# Altium project SCP.PrjPcb
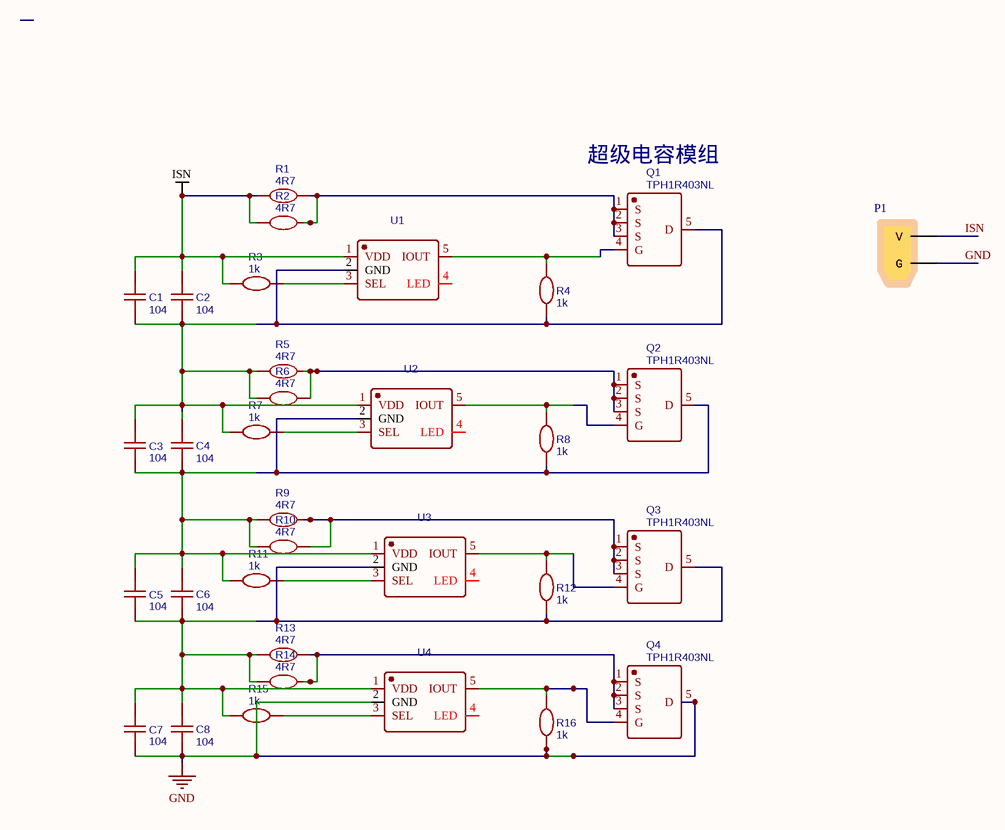
[diagram p0: SCP.SchDoc]
1 sheet, 33 parts. Net scope: global (net labels, ports and power ports of the same name join across sheets).
Board file: SCP.PcbDoc

## Sheet SCP.SchDoc
size A4; SheetNumber: 1; SheetTotal: 1

### Parts
C1  104  [C0805]
C2  104  [PCBComponent_1 - duplicate]
C3  104  [C0805]
C4  104  [PCBComponent_1 - duplicate]
C5  104  [C0805]
C6  104  [PCBComponent_1 - duplicate]
C7  104  [C0805]
C8  104  [PCBComponent_1 - duplicate]
P1  (no value)  [XT30 DIP]
Q1  TPH1R403NL  [POWERVDFN-8_L6.2-W5.2-P1.27-LS6.0-BL]
Q2  TPH1R403NL  [POWERVDFN-8_L6.2-W5.2-P1.27-LS6.0-BL]
Q3  TPH1R403NL  [POWERVDFN-8_L6.2-W5.2-P1.27-LS6.0-BL]
Q4  TPH1R403NL  [POWERVDFN-8_L6.2-W5.2-P1.27-LS6.0-BL]
R1  4R7  [R2512 1]
R2  4R7  [R2512 1]
R3  1k  [R0603]
R4  1k  [R0603]
R5  4R7  [R2512 1]
R6  4R7  [R2512 1]
R7  1k  [R0603]
R8  1k  [R0603]
R9  4R7  [R2512 1]
R10  4R7  [R2512 1]
R11  1k  [R0603]
R12  1k  [R0603]
R13  4R7  [R2512 1]
R14  4R7  [R2512 1]
R15  1k  [R0603]
R16  1k  [R0603]
U1  (no value)  [TSOT-23-5_L2.9-W1.6-P0.95-LS2.8-BL]
U2  (no value)  [TSOT-23-5_L2.9-W1.6-P0.95-LS2.8-BL]
U3  (no value)  [TSOT-23-5_L2.9-W1.6-P0.95-LS2.8-BL]
U4  (no value)  [TSOT-23-5_L2.9-W1.6-P0.95-LS2.8-BL]

### Nets
GND: C7.1 C8.1 P1.2(G) Q4.5(D) R16.1 U4.2(GND)
ISN: C1.2 C2.2 P1.1(V) R1.1 R2.1 R3.2 U1.1(VDD)
NetC1_1: C1.1 C2.1 C3.2 C4.2 Q1.5(D) R4.1 R5.1 R6.1 R7.2 U1.2(GND) U2.1(VDD)
NetC3_1: C3.1 C4.1 C5.2 C6.2 Q2.5(D) R8.1 R9.1 R10.1 R11.2 U2.2(GND) U3.1(VDD)
NetC5_1: C5.1 C6.1 C7.2 C8.2 Q3.5(D) R12.1 R13.1 R14.1 R15.2 U3.2(GND) U4.1(VDD)
NetQ1_1: Q1.1(S) Q1.2(S) Q1.3(S) R1.2 R2.2
NetQ1_4: Q1.4(G) R4.2 U1.5(IOUT)
NetQ2_1: Q2.1(S) Q2.2(S) Q2.3(S) R5.2 R6.2
NetQ2_4: Q2.4(G) R8.2 U2.5(IOUT)
NetQ3_1: Q3.1(S) Q3.2(S) Q3.3(S) R9.2 R10.2
NetQ3_4: Q3.4(G) R12.2 U3.5(IOUT)
NetQ4_1: Q4.1(S) Q4.2(S) Q4.3(S) R13.2 R14.2
NetQ4_4: Q4.4(G) R16.2 U4.5(IOUT)
NetR3_1: R3.1 U1.3(SEL)
NetR7_1: R7.1 U2.3(SEL)
NetR11_1: R11.1 U3.3(SEL)
NetR15_1: R15.1 U4.3(SEL)

Not connected (* = marked no-connect by the designer): U1 4(LED); U2 4(LED); U3 4(LED); U4 4(LED)

### Notes on the sheet
- (near Q1) 超级电容模组

### Library data of the parts
C1-C8 = 104: nameAlias: Value(F); Contributor: LCEDA_Lib; spicePre: C; spiceSymbolName: C_0805_US
P1 = XT30 DIP: XT30 板载直头直插
Q1-Q4 = TPH1R403NL: BOM_Manufacturer: TOSHIBA; BOM_Supplier: LCSC; BOM_Manufacturer Part: TPH1R403NL; BOM_Supplier Part: C83440; BOM_JLCPCB Part Class: Extended Part; spicePre: Q; spiceSymbolName: TPH1R403NL
R1 R2 R5 R6 R9 R10 R13 R14 = 4R7: BOM_Manufacturer: PANASONIC; BOM_Manufacturer Part: ERJPB6B4701V; nameAlias: Resistance (Ohms); Contributor: LCSC; BOM_Supplier: LCSC; BOM_Supplier Part: C413739; spicePre: R; spiceSymbolName: ERJPB6B4701V
R3 R4 R7 R8 R11 R12 R15 R16 = 1k: nameAlias: Value(Ω); Contributor: LCEDA_Lib; spicePre: R; spiceSymbolName: R_0603_EU
U1 U3 U4 = BW6101: BOM_Manufacturer: 00; SMT Type: Extend; Contributor: futuresailor; BOM_Manufacturer Part: 00; BOM_Supplier Part: 0000; BOM_LCSC Assembly: Yes; link: 00; spicePre: U; spiceSymbolName: BW6101
U2 = BW6101: SMT Type: Extend; Contributor: futuresailor; BOM_LCSC Assembly: Yes; link: 00; spicePre: U; spiceSymbolName: BW6101